# Altium project Flytta-36.PrjPcb
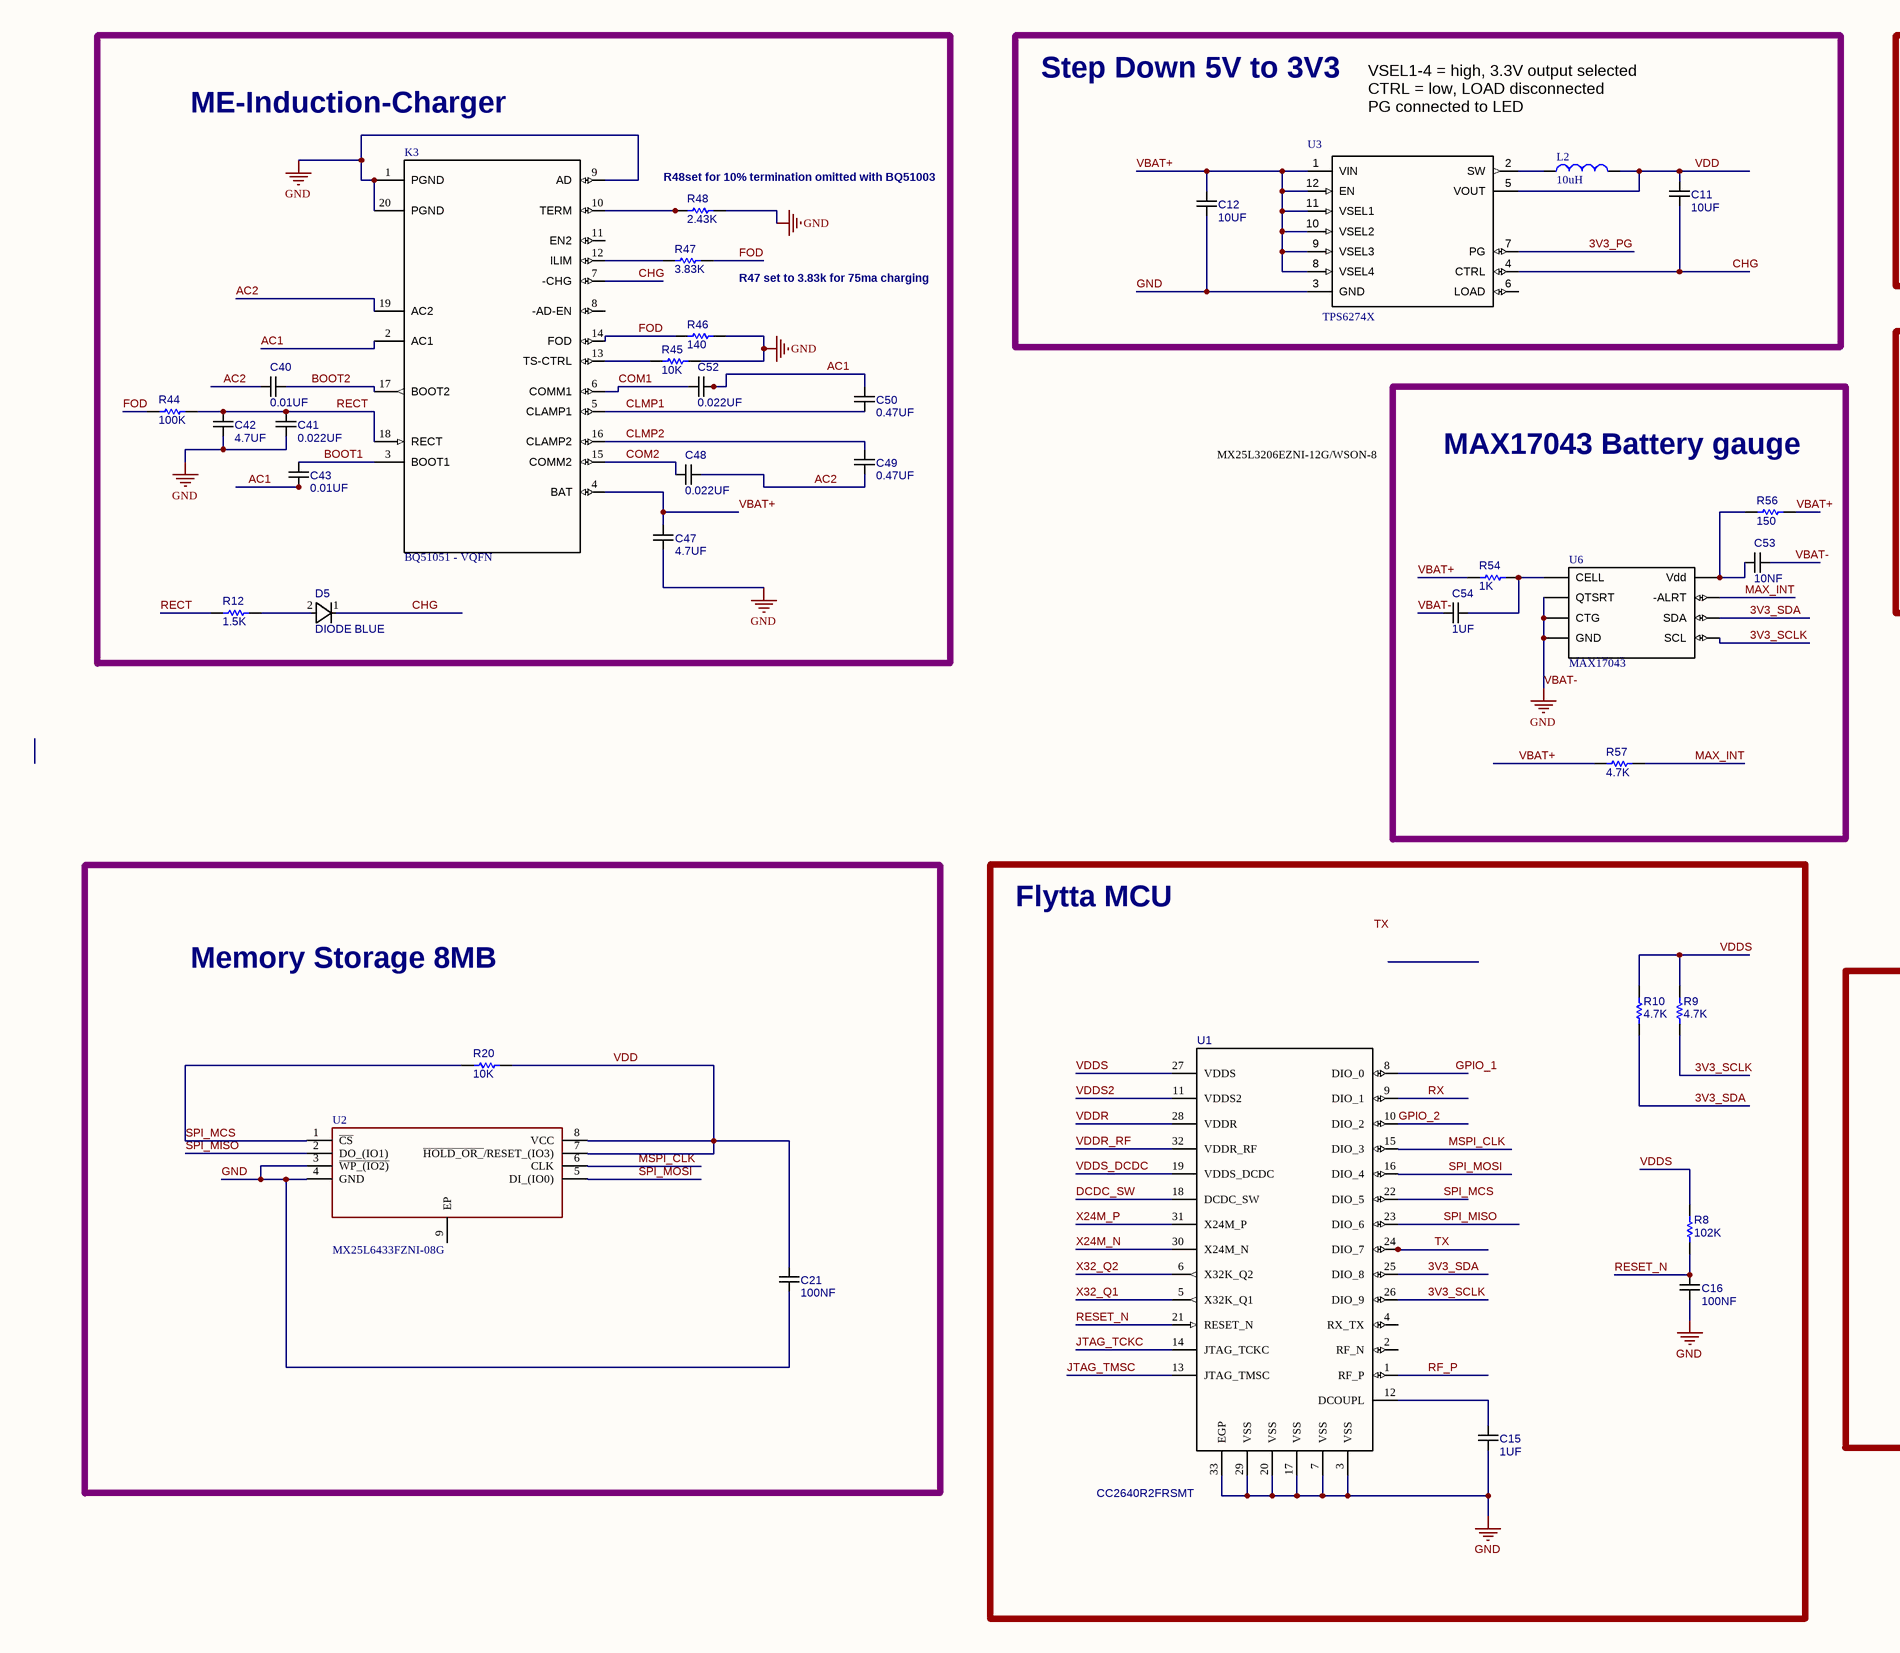
[diagram p0: Flytta-36.SchDoc, left]
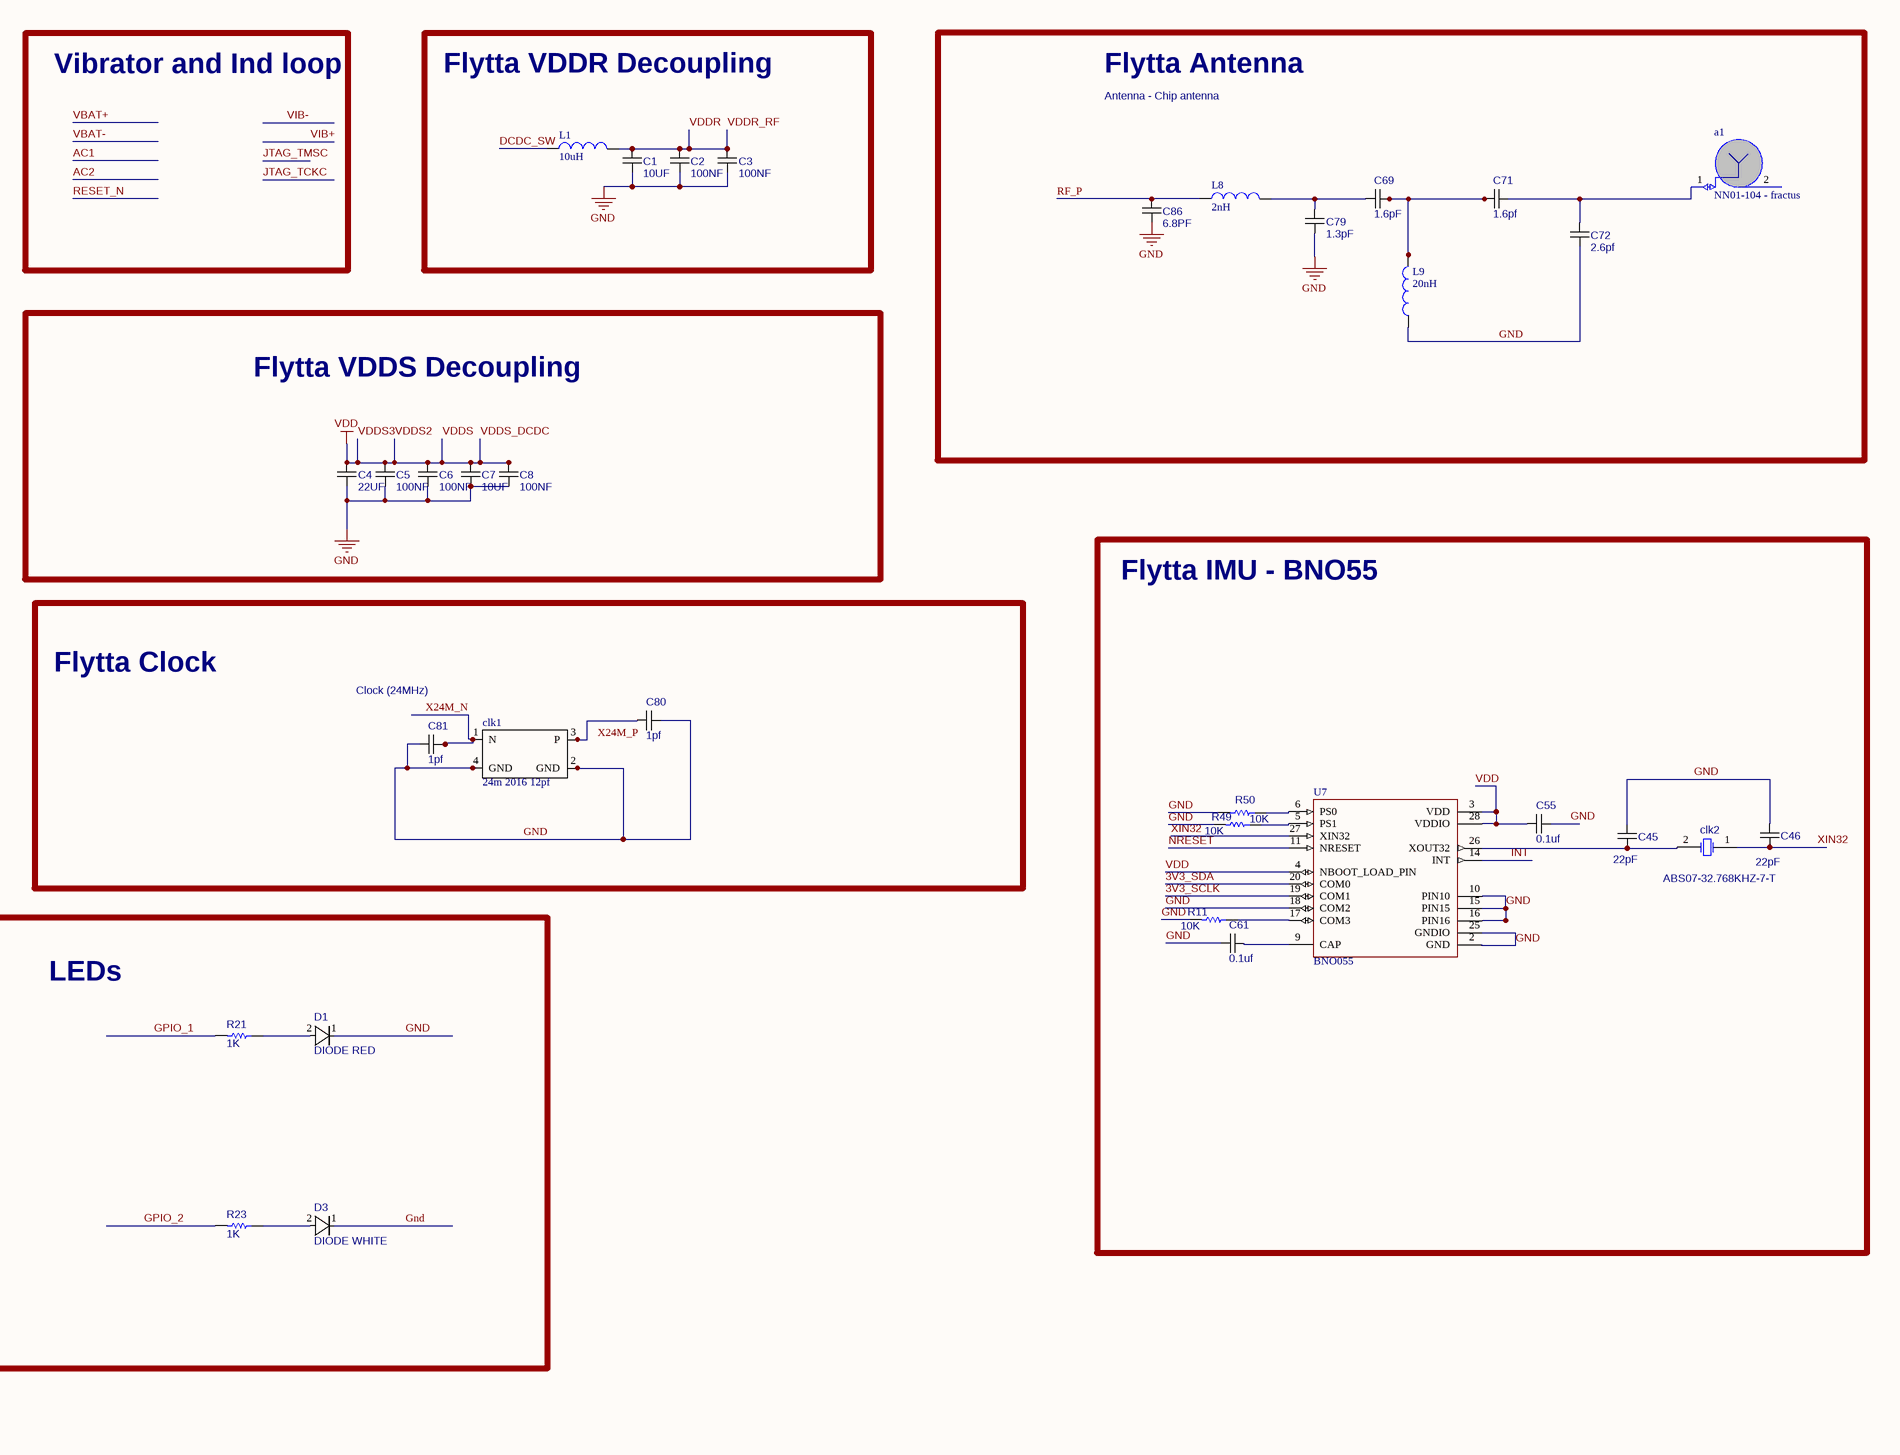
[diagram p1: Flytta-36.SchDoc, right]
1 sheet, 69 parts. Net scope: global (net labels, ports and power ports of the same name join across sheets).
Board file: Flytta-36.PcbDoc

## Sheet Flytta-36.SchDoc
size A1

### Parts
a1  NN01-104 - fractus  [fractus-chip-antenna]
C1  10UF  [Passive (0402, 1005)]
C2  100NF  [Passive (0402, 1005)]
C3  100NF  [PASSIVE (0201, 0603)]
C4  22UF  [Passive (0603, 1608)]
C5  100NF  [PASSIVE (0201, 0603)]
C6  100NF  [PASSIVE (0201, 0603)]
C7  10UF  [Passive (0402, 1005)]
C8  100NF  [PASSIVE (0201, 0603)]
C11  10UF  [Passive (0402, 1005)]
C12  10UF  [Passive (0402, 1005)]  (net tie)
C15  1UF  [PASSIVE (0201, 0603)]
C16  100NF  [PASSIVE (0201, 0603)]
C21  100NF  [PASSIVE (0201, 0603)]
C40  0.01UF  [PASSIVE (0201, 0603)]
C41  0.022UF  [PASSIVE (0201, 0603)]
C42  4.7UF  [PASSIVE (0201, 0603)]
C43  0.01UF  [PASSIVE (0201, 0603)]
C45  22pF  [PASSIVE (0201, 0603)]
C46  22pF  [PASSIVE (0201, 0603)]
C47  4.7UF  [PASSIVE (0201, 0603)]
C48  0.022UF  [PASSIVE (0201, 0603)]
C49  0.47UF  [PASSIVE (0201, 0603)]
C50  0.47UF  [PASSIVE (0201, 0603)]
C52  0.022UF  [PASSIVE (0201, 0603)]
C53  10NF  [PASSIVE (0201, 0603)]
C54  1UF  [PASSIVE (0201, 0603)]
C55  0.1uf  [PASSIVE (0201, 0603)]
C61  0.1uf  [PASSIVE (0201, 0603)]
C69  1.6pF  [Passive (0402, 1005)]
C71  1.6pf  [Passive (0402, 1005)]
C72  2.6pf  [Passive (0402, 1005)]
C79  1.3pF  [Passive (0402, 1005)]
C80  1pf  [Passive (0402, 1005)]
C81  1pf  [Passive (0402, 1005)]
C86  6.8PF  [Passive (0402, 1005)]
clk1  24m 2016 12pf  [24mhz creatway clock]
clk2  ABS07-32.768KHZ-7-T  [ABS07]
D1  DIODE RED  [Diode]
D3  DIODE WHITE  [Diode]
D5  DIODE BLUE  [Diode]
K3  BQ51051 - VQFN  [bq51051 - vqfn]
L1  10uH  [Passive (0603, 1608)]
L2  10uH  [Passive (0603, 1608)]
L8  2nH  [Passive (0402, 1005)]
L9  20nH  [Passive (0402, 1005)]
R8  102K  [PASSIVE (0201, 0603)]
R9  4.7K  [PASSIVE (0201, 0603)]
R10  4.7K  [PASSIVE (0201, 0603)]
R11  10K  [PASSIVE (0201, 0603)]
R12  1.5K  [PASSIVE (0201, 0603)]
R20  10K  [PASSIVE (0201, 0603)]
R21  1K  [PASSIVE (0201, 0603)]
R23  1K  [PASSIVE (0201, 0603)]
R44  100K  [PASSIVE (0201, 0603)]
R45  10K  [PASSIVE (0201, 0603)]
R46  140  [PASSIVE (0201, 0603)]
R47  3.83K  [PASSIVE (0201, 0603)]
R48  2.43K  [PASSIVE (0201, 0603)]
R49  10K  [PASSIVE (0201, 0603)]
R50  10K  [PASSIVE (0201, 0603)]
R54  1K  [PASSIVE (0201, 0603)]
R56  150  [PASSIVE (0201, 0603)]
R57  4.7K  [PASSIVE (0201, 0603)]
U1  CC2640R2FRSMT  [RSM0032B]
U2  MX25L6433FZNI-08G  [MX25L32]
U3  TPS6274X  [TPS6274]
U6  MAX17043  [MAX17043]
U7  BNO055  [BNO055]

### Blocks framed on the sheet
ME-Induction-Charger: C40-C43 C47-C50 C52 D5 K3 R12 R44-R48
Step Down 5V to 3V3: C11 C12 L2 U3
Flytta VDDR Decoupling: C1-C3 L1
Flytta Antenna: a1 C69 C71 C72 C79 C86 L8 L9
Flytta VDDS Decoupling: C4-C8
MAX17043 Battery gauge: C53 C54 R54 R56 R57 U6
Flytta IMU - BNO55: C45 C46 C55 C61 clk2 R11 R49 R50 U7
Flytta Clock: C80 C81 clk1
Memory Storage 8MB: C21 R20 U2
Flytta MCU: C15 C16 R8-R10 U1
LEDs: D1 D3 R21 R23

### Nets
GND: C1.1 C2.1 C3.1 C4.1 C5.1 C6.1 C7.1 C8.1 C12.1 C15.1 C16.1 C21.2 C41.2 C42.2 C45.2 C46.2 C47.2 C53.2 C54.1 C55.2 C61.2 C72.1 C79.1 C80.2 C81.1 C86.1 clk1.2(GND) clk1.4(GND) D1.1 D3.1 K3.1(PGND) K3.9(AD) K3.20(PGND) L9.1 R11.2 R45.1 R46.1 R48.1 R49.2 R50.2 U1.3(VSS) U1.7(VSS) U1.17(VSS) U1.20(VSS) U1.29(VSS) U1.33(EGP) U2.3(~{WP_(IO2)}) U2.4(GND) U3.3(GND) U6.A3(CTG) U6.B1(QTSRT) U6.C3(GND) U7.2(GND) U7.10(PIN10) U7.15(PIN15) U7.16(PIN16) U7.18(COM2) U7.25(GNDIO)  [also labelled VBAT-]
VDD: C4.2 C5.2 C6.2 C7.2 C8.2 C11.2 C21.1 C55.1 L2.2 R8.2 R9.2 R10.2 R20.1 U1.11(VDDS2) U1.19(VDDS_DCDC) U1.27(VDDS) U2.7(~{HOLD_OR_}/RESET_(IO3)) U2.8(VCC) U3.5(VOUT) U7.3(VDD) U7.4(NBOOT_LOAD_PIN) U7.28(VDDIO)  [also labelled VDDS, VDDS2, VDDS3, VDDS_DCDC]
3V3_PG: U3.7(PG)
3V3_SCLK: R9.1 U1.26(DIO_9) U6.A2(SCL) U7.19(COM1)
3V3_SDA: R10.1 U1.25(DIO_8) U6.A1(SDA) U7.20(COM0)
AC1: C43.2 C50.1 C52.2 K3.2(AC1)
AC2: C40.2 C48.2 C49.2 K3.19(AC2)
BOOT1: C43.1 K3.3(BOOT1)
BOOT2: C40.1 K3.17(BOOT2)
CHG: C11.1 D5.1 K3.7(-CHG) U3.4(CTRL)
CLMP1: C50.2 K3.5(CLAMP1)
CLMP2: C49.1 K3.16(CLAMP2)
COM1: C52.1 K3.6(COMM1)
COM2: C48.1 K3.15(COMM2)
DCDC_SW: L1.1 U1.18(DCDC_SW)
FOD: K3.14(FOD) R44.2 R46.2 R47.1
GPIO_1: R21.2 U1.8(DIO_0)
GPIO_2: R23.2 U1.10(DIO_2)
INT: U7.14(INT)
JTAG_TCKC: U1.14(JTAG_TCKC)
JTAG_TMSC: U1.13(JTAG_TMSC)
MAX_INT: R57.1 U6.C1(-ALRT)
MSPI_CLK: U1.15(DIO_3) U2.6(CLK)
NRESET: U7.11(NRESET)
RECT: C41.1 C42.1 K3.18(RECT) R12.2 R44.1
RESET_N: C16.2 R8.1 U1.21(RESET_N)
RF_P: C86.2 L8.1 U1.1(RF_P)
RX: U1.9(DIO_1)
SPI_MCS: R20.2 U1.22(DIO_5) U2.1(~{CS})
SPI_MISO: U1.23(DIO_6) U2.2(DO_(IO1))
SPI_MOSI: U1.16(DIO_4) U2.5(DI_(IO0))
TX: U1.24(DIO_7)
VBAT+: C12.2 C47.1 K3.4(BAT) R54.2 R56.1 R57.2 U3.1(VIN) U3.8(VSEL4) U3.9(VSEL3) U3.10(VSEL2) U3.11(VSEL1) U3.12(EN)
VDDR: C1.2 C2.2 C3.2 L1.2 U1.28(VDDR) U1.32(VDDR_RF)  [also labelled VDDR_RF]
X24M_N: C81.2 clk1.1(N) U1.30(X24M_N)
X24M_P: U1.31(X24M_P)
X32_Q1: U1.5(X32K_Q1)
X32_Q2: U1.6(X32K_Q2)
XIN32: C46.1 clk2.1(OSC1) U7.27(XIN32)
Neta1_1: a1.1(FEED1) C71.1 C72.2
NetC15_2: C15.2 U1.12(DCOUPL)
NetC45_1: C45.1 clk2.2(OSC2) U7.26(XOUT32)
NetC53_1: C53.1 R56.2 U6.C2(Vdd)
NetC54_2: C54.2 R54.1 U6.B3(CELL)
NetC61_1: C61.1 U7.9(CAP)
NetC69_1: C69.1 C71.2 L9.2
NetC69_2: C69.2 C79.2 L8.2
NetC80_1: C80.1 clk1.3(P)
NetD1_2: D1.2 R21.1
NetD3_2: D3.2 R23.1
NetD5_2: D5.2 R12.1
NetK3_10: K3.10(TERM) R48.2
NetK3_12: K3.12(ILIM) R47.2
NetK3_13: K3.13(TS-CTRL) R45.2
NetL2_1: L2.1 U3.2(SW)
NetR11_1: R11.1 U7.17(COM3)
NetR49_1: R49.1 U7.5(PS1)
NetR50_1: R50.1 U7.6(PS0)

Not connected (* = marked no-connect by the designer): a1 2(GND); K3 8(-AD-EN) 11(EN2); U1 2(RF_N) 4(RX_TX); U2 9(EP); U3 6(LOAD)

### Notes on the sheet
- VSEL1-4 = high, 3.3V output selected
  CTRL = low, LOAD disconnected
  PG connected to LED
- Vibrator and Ind loop
- Antenna - Chip antenna
- (near R48) R48set for 10% termination omitted with BQ51003
- R47 set to 3.83k for 75ma charging
- MX25L3206EZNI-12G/WSON-8
- Clock (24MHz)
- Labels drawn without touching a wire or pin: TX, X24M_P

### Library data of the parts
a1 = fractus-chip-antenna: NN01-104
C1-C8 C11 C12 C15 C16 C21 C40-C43 C45-C50 C52-C55 C61 C69 C79-C81 C86 = Capacitor: Ceramic chip capacitor; Value: *
C71 = Capacitor: GJM11555C1H1R6JB01; Value: *
C72 = Capacitor: GJM1555C1H2R6BB01; Value: *
clk2 = ABS07-32.768KHZ-7-T: 32 kHz
D1 = DIODE: VLMW1500 - WHITE
D3 = DIODE: VLMW1500 -WHITE
D5 = DIODE: VLMW1500 -BLUE
L1 L2 L8 = Inductor: Code_IEC: 1005; Value: 10mH; Published: 8-Jun-2000; LatestRevisionDate: 29-May-2009; LatestRevisionNote: IPC-7351 Footprint Added.; PackageReference: 0402-A; Publisher: Altium Limited; PackageDescription: Chip Inductor; Code_JEITA: 0402
L9 = Inductor: LQW15AN20NH00; Code_IEC: 1005; Value: 10mH; Published: 8-Jun-2000; LatestRevisionDate: 29-May-2009; LatestRevisionNote: IPC-7351 Footprint Added.; PackageReference: 0402-A; Publisher: Altium Limited; PackageDescription: Chip Inductor; Code_JEITA: 0402
R8-R12 R20 R21 R23 R44-R50 R54 R56 R57 = Resistor: Value: *
U1 = CC2650F128RSMT: CC26xx; Manufacturer: Texas Instruments; CompType: IC; PIN_COUNT: 33; Application_BuildNumber: *; PartNumber: CC2650F128RSMT; Alternate PartNumber: CC2650F128RSMT; PackageReference: RSM0032B; MountType: SMT; RoHS: Y; RefDes: RefDes; Type: DEV
U2 = MX25L32
U3 = TPS6274X: Step down converter
U6 = MAX17043: I2C battery gauge